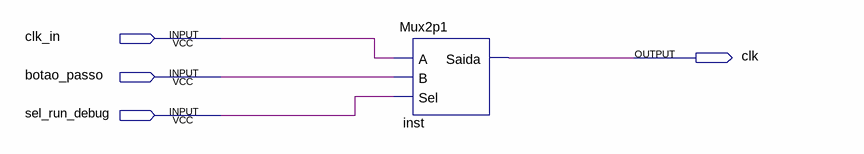
[diagram p0: schematic sheet]
// Quartus schematic Run_Debug.bdf as structural Verilog: 1 symbols, 4 pins
module Run_Debug (
  input  clk_in,
  input  botao_passo,
  input  sel_run_debug,
  output clk
);

  Mux2p1 inst (.A(clk_in), .B(botao_passo), .Sel(sel_run_debug), .Saida(clk));
endmodule
